# EAGLE design BIGDOGLAYOUT (EAGLE 7.2.0)
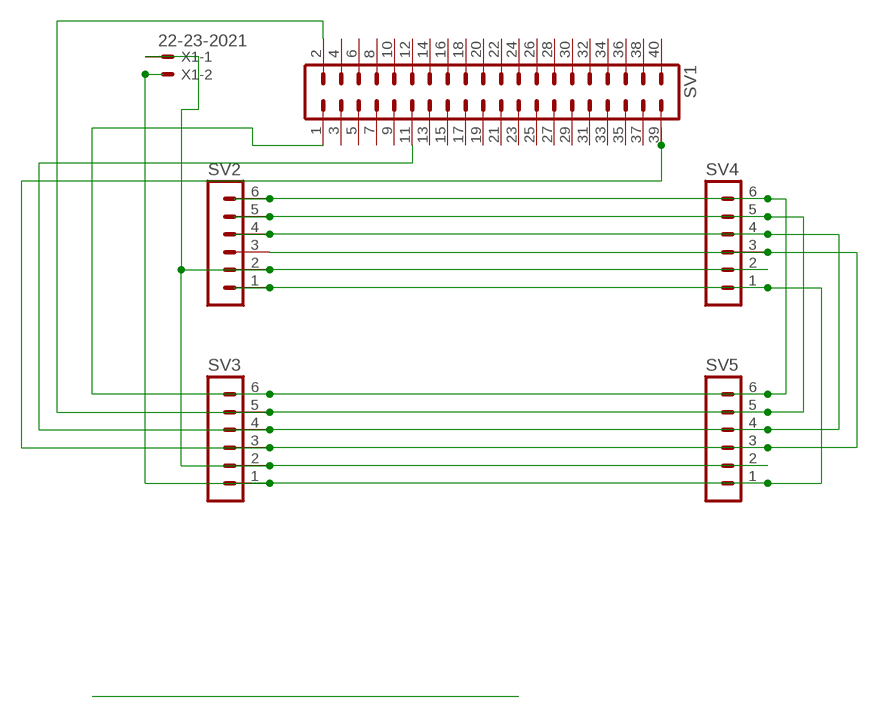
[diagram p0: schematic, sheet 1]

## Parts
SV1  MA20-2  [MA20-2]
SV2  MA06-1  [MA06-1]
SV3  MA06-1  [MA06-1]
SV4  MA06-1  [MA06-1]
SV5  MA06-1  [MA06-1]
X1  22-23-2021  [22-23-2021]

## Nets
N$3: SV2.2 SV3.2 SV4.2 SV5.2 X1.1
N$4: SV1.2 SV2.5 SV3.5 SV4.5 SV5.5
N$6: SV1.11 SV2.4 SV3.4 SV4.4 SV5.4
N$7: SV1.1 SV2.6 SV3.6 SV4.6 SV5.6
N$8: SV1.39 SV2.3 SV3.3 SV4.3 SV5.3
N$18: SV2.1 SV3.1 SV4.1 SV5.1 X1.2
Unconnected: SV1.3 SV1.4 SV1.5 SV1.6 SV1.7 SV1.8 SV1.9 SV1.10 SV1.12 SV1.13 SV1.14 SV1.15 SV1.16 SV1.17 SV1.18 SV1.19 SV1.20 SV1.21 SV1.22 SV1.23 SV1.24 SV1.25 SV1.26 SV1.27 SV1.28 SV1.29 SV1.30 SV1.31 SV1.32 SV1.33 SV1.34 SV1.35 SV1.36 SV1.37 SV1.38 SV1.40

## Library data of the parts
SV1 = con-lstb:MA20-2: PIN HEADER; OC_FARNELL: unknown; OC_NEWARK: unknown
SV2-SV5 = con-lstb:MA06-1: PIN HEADER; OC_FARNELL: unknown; OC_NEWARK: unknown
X1 = con-molex:22-23-2021: .100" (2.54mm) Center Header - 2 Pin; MF: MOLEX; MPN: 22-23-2021; OC_FARNELL: 1462926; OC_NEWARK: 25C3832

## Board
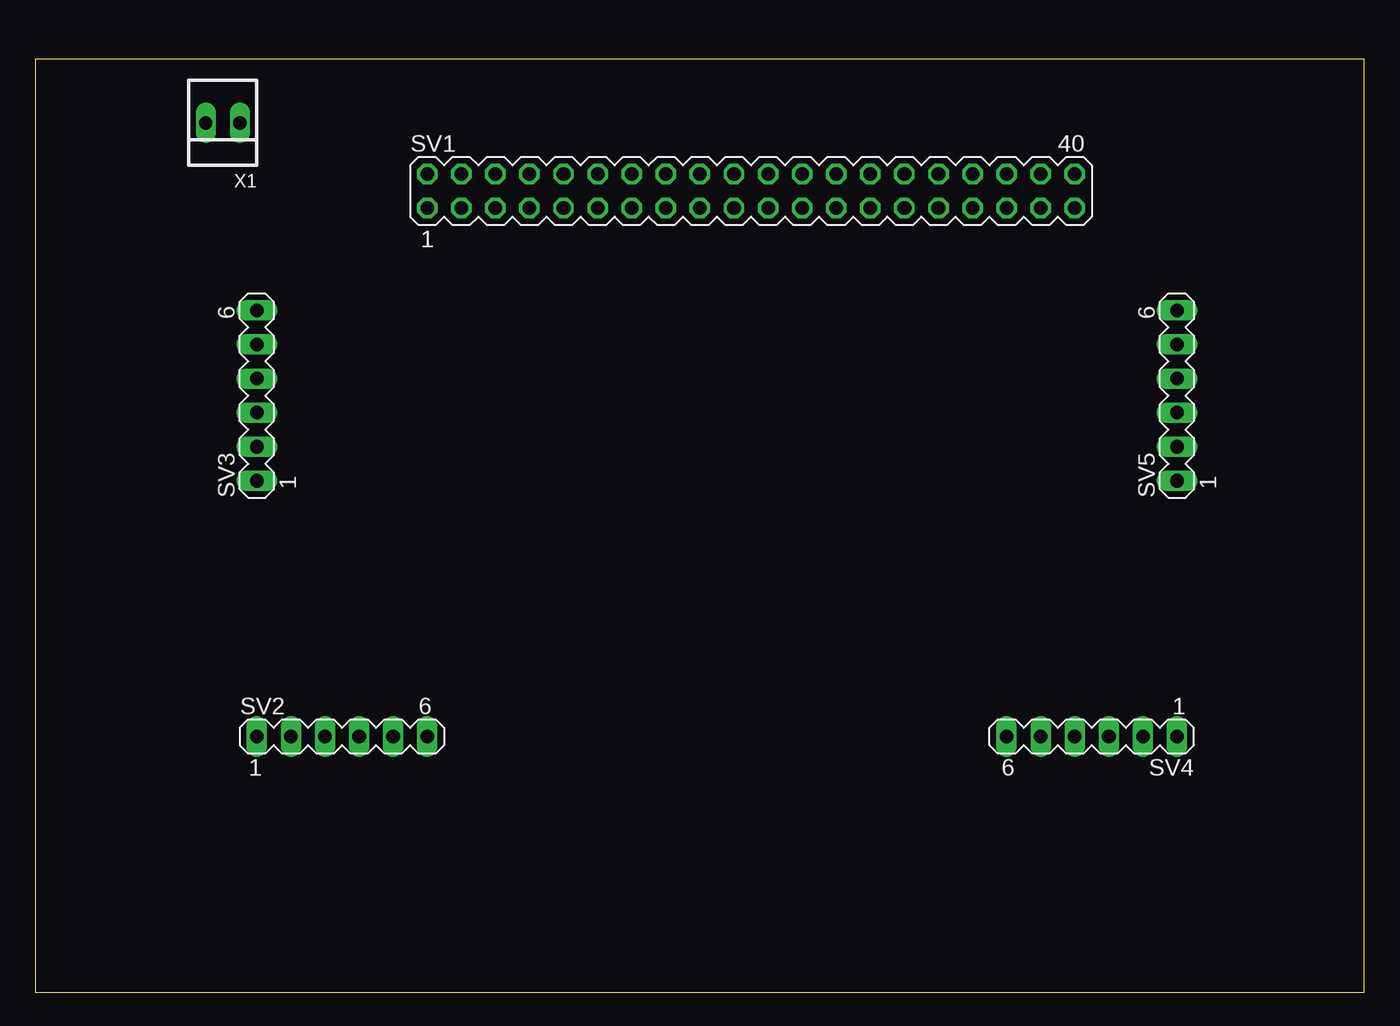
[diagram p1: board, top side]
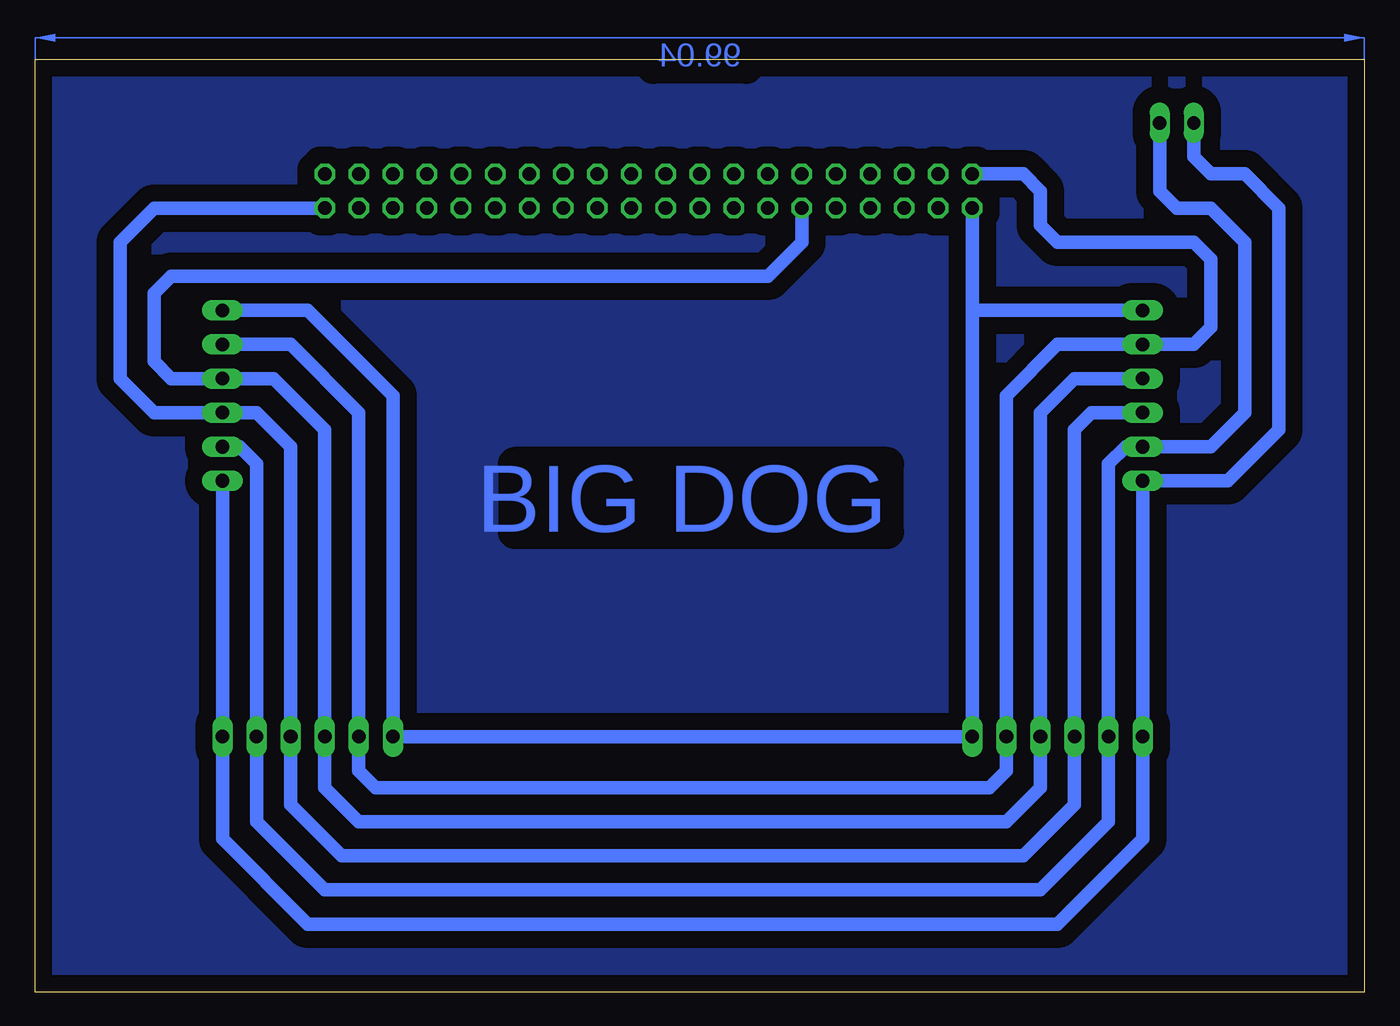
[diagram p2: board, bottom side, seen from below]

Size 99.04 x 69.52 mm. Coordinates in mm from the lower left corner, seen from the top.
Outline: 0,0 99.04,0 99.04,69.52 0,69.52 0,0
Copper layers (1*16): Top 0.035mm / dielectric 1.5mm / Bottom 0.035mm
Design rules "default": minimum track width 10mil, minimum drill 24mil, track to track 8mil, track to pad 8mil, pad to pad 8mil, via to via 8mil, smd to smd 8mil, copper to edge 40mil, drill to drill 8mil, minimum pad ring 10mil, minimum via ring 8mil, stop-mask expansion 4mil, vias tented up to drill 0mil, thermal gap 10mil

### Footprints (pad centres in the part's own frame; a part is rotated, then mirrored left to right if it is on the bottom)
MA20-2 = drill 1.016 octagon: 1 -24.13,-1.27; 2 -24.13,1.27; 3 -21.59,-1.27; 4 -21.59,1.27; 5 -19.05,-1.27; 6 -19.05,1.27; 7 -16.51,-1.27; 8 -16.51,1.27; 9 -13.97,-1.27; 10 -13.97,1.27; 11 -11.43,-1.27; 12 -11.43,1.27; 13 -8.89,-1.27; 14 -8.89,1.27; 15 -6.35,-1.27; 16 -6.35,1.27; 17 -3.81,-1.27; 18 -3.81,1.27; 19 -1.27,-1.27; 20 -1.27,1.27; 21 1.27,-1.27; 22 1.27,1.27; 23 3.81,-1.27; 24 3.81,1.27; 25 6.35,-1.27; 26 6.35,1.27; 27 8.89,-1.27; 28 8.89,1.27; 29 11.43,-1.27; 30 11.43,1.27; 31 13.97,-1.27; 32 13.97,1.27; 33 16.51,-1.27; 34 16.51,1.27; 35 19.05,-1.27; 36 19.05,1.27; 37 21.59,-1.27; 38 21.59,1.27; 39 24.13,-1.27; 40 24.13,1.27
MA06-1 = drill 1.016 long: 1 -6.35,0; 2 -3.81,0; 3 -1.27,0; 4 1.27,0; 5 3.81,0; 6 6.35,0
22-23-2021 = drill 1 long: 1 -1.27,0; 2 1.27,0

### Placement (x,y rotation side)
SV1  53.34,59.69 0 top
SV2  22.86,19.05 0 top
SV3  16.51,44.45 90 top
SV4  78.74,19.05 180 top
SV5  85.09,44.45 90 top
X1  13.97,64.77 180 top

### Tracks (layer width: path | path; a pad name or v marks a point on that pad's centre or on a via)
N$1
  pour Bottom (isolate 1.27): 0,69.85 99.06,69.85 99.06,0 0,0
N$3
  Bottom 1.016: SV5.2 83.82,40.64 82.55,39.37 SV4.2 82.55,12.7 77.47,7.62 24.13,7.62 19.05,12.7 SV2.2 19.05,39.37 17.78,40.64 SV3.2 11.43,40.64 8.89,43.18 8.89,55.88 11.43,58.42 13.97,58.42 15.24,59.69 X1.1
N$4
  Bottom 1.016: SV4.5 74.93,16.51 73.66,15.24 27.94,15.24 26.67,16.51 SV2.5 26.67,44.45 22.86,48.26 SV3.5 12.7,48.26 11.43,49.53 11.43,54.61 12.7,55.88 22.86,55.88 24.13,57.15 24.13,59.69 25.4,60.96 SV1.2 | 74.93,20.32 SV4.5 | SV4.5 74.93,43.18 80.01,48.26 SV5.5
N$6
  Bottom 1.016: SV3.4 21.59,45.72 24.13,43.18 SV2.4 24.13,15.24 26.67,12.7 74.93,12.7 77.47,15.24 SV4.4 77.47,41.91 81.28,45.72 SV5.4 88.9,45.72 90.17,46.99 90.17,52.07 88.9,53.34 44.45,53.34 41.91,55.88 SV1.11
N$7
  Bottom 1.016: 29.21,50.8 SV2.6 SV4.6 72.39,44.45 78.74,50.8 SV5.6 | 29.21,50.8 SV1.1 | 29.21,50.8 SV3.6
N$8
  Bottom 1.016: SV3.3 20.32,43.18 21.59,41.91 SV2.3 21.59,13.97 25.4,10.16 76.2,10.16 80.01,13.97 SV4.3 80.01,40.64 82.55,43.18 SV5.3 90.17,43.18 92.71,45.72 92.71,55.88 90.17,58.42 SV1.39
N$18
  Bottom 1.016: X1.2 12.7,62.23 11.43,60.96 8.89,60.96 6.35,58.42 6.35,41.91 10.16,38.1 SV3.1 SV2.1 16.51,11.43 22.86,5.08 78.74,5.08 85.09,11.43 SV4.1 SV5.1
(copper drawn outside any net)
  shapes: Bottom area x1

### Text on the board
Bottom: BIG DOG